# EAGLE schematic ice header adapter pcb (EAGLE 7.3.0)
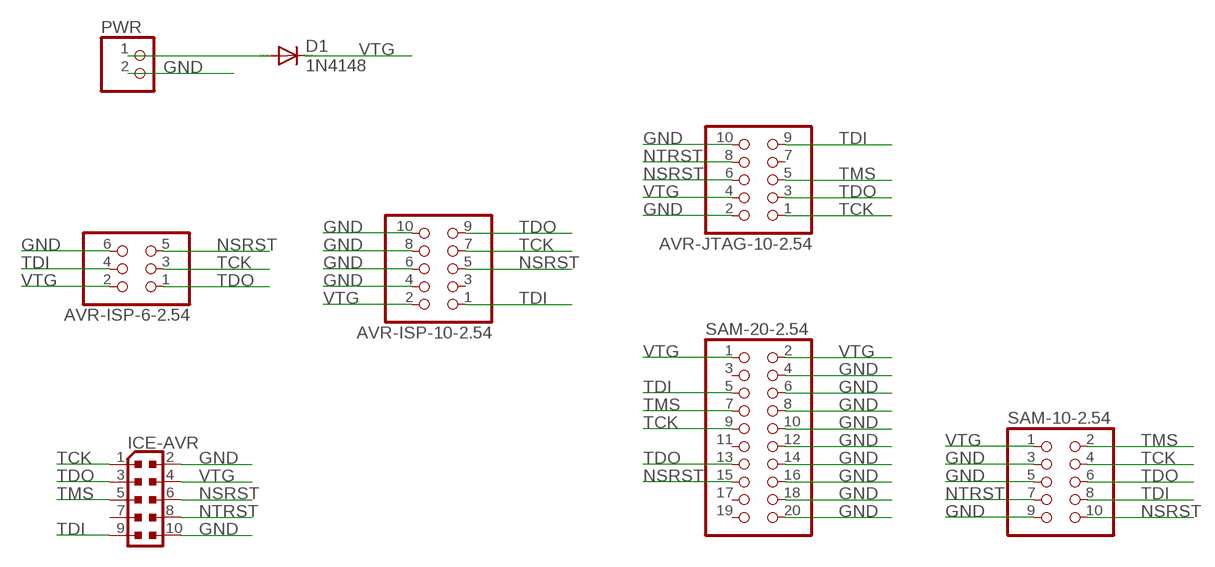
[diagram p0: schematic, sheet 1]

## Parts
AVR-ISP-6-2.54  PINHD-2X3  [2X03]
AVR-ISP-10-2.54  PINHD-2X5  [2X05]
AVR-JTAG-10-2.54  PINHD-2X5  [2X05]
D1  1N4148  1N4148DO35-7  [DO35-7]
ICE-AVR  PINHEAD_PINHD-2X5PASSO127  [PINHEAD_2X05_127]
PWR  PINHD-1X2/90  [1X02/90]
SAM-10-2.54  PINHD-2X5  [2X05]
SAM-20-2.54  PINHD-2X10  [2X10]

## Nets
GND [pwr]: AVR-ISP-6-2.54.6 AVR-ISP-10-2.54.4 AVR-ISP-10-2.54.6 AVR-ISP-10-2.54.8 AVR-ISP-10-2.54.10 AVR-JTAG-10-2.54.2 AVR-JTAG-10-2.54.10 ICE-AVR.2 ICE-AVR.10 PWR.2 SAM-10-2.54.3 SAM-10-2.54.5 SAM-10-2.54.9 SAM-20-2.54.4 SAM-20-2.54.6 SAM-20-2.54.8 SAM-20-2.54.10 SAM-20-2.54.12 SAM-20-2.54.14 SAM-20-2.54.16 SAM-20-2.54.18 SAM-20-2.54.20
N$2: D1.A PWR.1
NSRST: AVR-ISP-6-2.54.5 AVR-ISP-10-2.54.5 AVR-JTAG-10-2.54.6 ICE-AVR.6 SAM-10-2.54.10 SAM-20-2.54.15
NTRST: AVR-JTAG-10-2.54.8 ICE-AVR.8 SAM-10-2.54.7
TCK: AVR-ISP-6-2.54.3 AVR-ISP-10-2.54.7 AVR-JTAG-10-2.54.1 ICE-AVR.1 SAM-10-2.54.4 SAM-20-2.54.9
TDI: AVR-ISP-6-2.54.4 AVR-ISP-10-2.54.1 AVR-JTAG-10-2.54.9 ICE-AVR.9 SAM-10-2.54.8 SAM-20-2.54.5
TDO: AVR-ISP-6-2.54.1 AVR-ISP-10-2.54.9 AVR-JTAG-10-2.54.3 ICE-AVR.3 SAM-10-2.54.6 SAM-20-2.54.13
TMS: AVR-JTAG-10-2.54.5 ICE-AVR.5 SAM-10-2.54.2 SAM-20-2.54.7
VTG [pwr]: AVR-ISP-6-2.54.2 AVR-ISP-10-2.54.2 AVR-JTAG-10-2.54.4 D1.C ICE-AVR.4 SAM-10-2.54.1 SAM-20-2.54.1 SAM-20-2.54.2
Unconnected: AVR-ISP-10-2.54.3 AVR-JTAG-10-2.54.7 ICE-AVR.7 SAM-20-2.54.3 SAM-20-2.54.11 SAM-20-2.54.17 SAM-20-2.54.19

## Library data of the parts
AVR-ISP-6-2.54 = pinhead:PINHD-2X3: PIN HEADER
AVR-ISP-10-2.54 AVR-JTAG-10-2.54 SAM-10-2.54 = pinhead:PINHD-2X5: PIN HEADER
D1 = diode:1N4148: DIODE high speed (Philips)
ICE-AVR = Arduino_Wifi_shield_v018_tG:PINHEAD_PINHD-2X5: PIN HEADER
PWR = pinhead:PINHD-1X2: PIN HEADER
SAM-20-2.54 = pinhead:PINHD-2X10: PIN HEADER

## Net classes
0 default: width 0.3 mm, drill 0.3 mm, clearance 0.25 mm
1 pwr: width 0.5 mm, drill 0.5 mm, clearance 0.25 mm